# Altium schematic sheet Sheet2.SchDoc
size A4
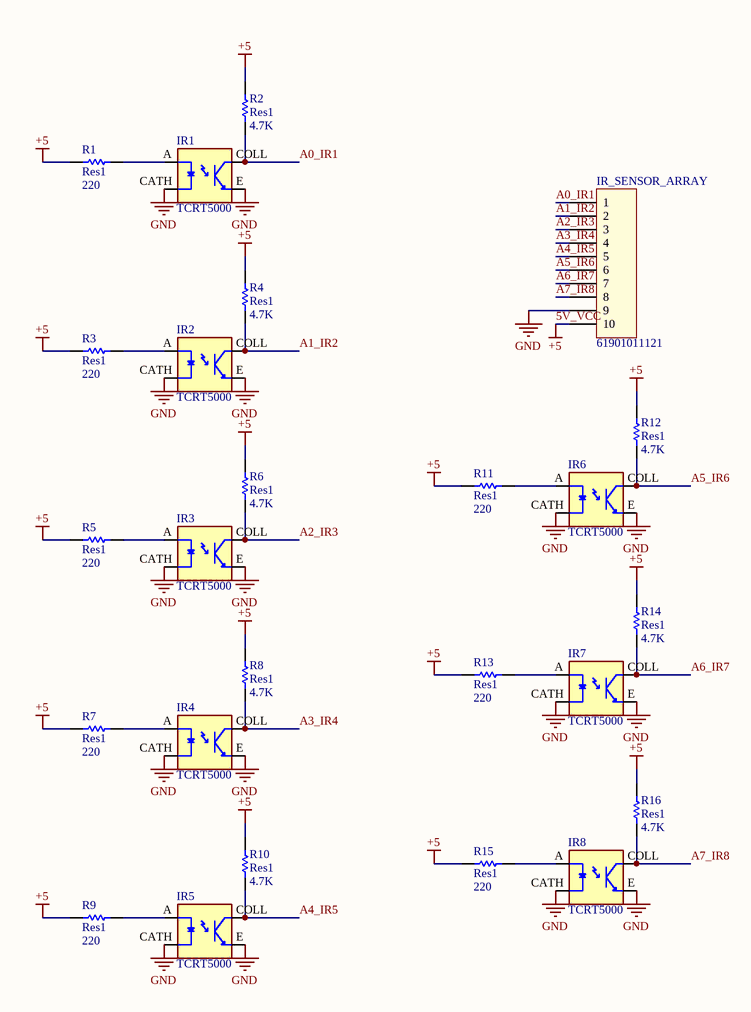
[diagram p0: Sheet2.SchDoc]

## Parts
IR1  TCRT5000  [OPTO_TCRT5000]
IR2  TCRT5000  [OPTO_TCRT5000]
IR3  TCRT5000  [OPTO_TCRT5000]
IR4  TCRT5000  [OPTO_TCRT5000]
IR5  TCRT5000  [OPTO_TCRT5000]
IR6  TCRT5000  [OPTO_TCRT5000]
IR7  TCRT5000  [OPTO_TCRT5000]
IR8  TCRT5000  [OPTO_TCRT5000]
IR_SENSOR_ARRAY  61901011121  [61901011121]
R1  Res1  value 220  [AXIAL-0.3]
R2  Res1  value 4.7K  [AXIAL-0.3]
R3  Res1  value 220  [AXIAL-0.3]
R4  Res1  value 4.7K  [AXIAL-0.3]
R5  Res1  value 220  [AXIAL-0.3]
R6  Res1  value 4.7K  [AXIAL-0.3]
R7  Res1  value 220  [AXIAL-0.3]
R8  Res1  value 4.7K  [AXIAL-0.3]
R9  Res1  value 220  [AXIAL-0.3]
R10  Res1  value 4.7K  [AXIAL-0.3]
R11  Res1  value 220  [AXIAL-0.3]
R12  Res1  value 4.7K  [AXIAL-0.3]
R13  Res1  value 220  [AXIAL-0.3]
R14  Res1  value 4.7K  [AXIAL-0.3]
R15  Res1  value 220  [AXIAL-0.3]
R16  Res1  value 4.7K  [AXIAL-0.3]

## Nets
5V_VCC: IR_SENSOR_ARRAY.10 R1.1 R2.2 R3.1 R4.2 R5.1 R6.2 R7.1 R8.2 R9.1 R10.2 R11.1 R12.2 R13.1 R14.2 R15.1 R16.2  [also labelled +5]
GND: IR1.CATH IR1.E IR2.CATH IR2.E IR3.CATH IR3.E IR4.CATH IR4.E IR5.CATH IR5.E IR6.CATH IR6.E IR7.CATH IR7.E IR8.CATH IR8.E IR_SENSOR_ARRAY.9
A0_IR1: IR1.COLL IR_SENSOR_ARRAY.1 R2.1
A1_IR2: IR2.COLL IR_SENSOR_ARRAY.2 R4.1
A2_IR3: IR3.COLL IR_SENSOR_ARRAY.3 R6.1
A3_IR4: IR4.COLL IR_SENSOR_ARRAY.4 R8.1
A4_IR5: IR5.COLL IR_SENSOR_ARRAY.5 R10.1
A5_IR6: IR6.COLL IR_SENSOR_ARRAY.6 R12.1
A6_IR7: IR7.COLL IR_SENSOR_ARRAY.7 R14.1
A7_IR8: IR8.COLL IR_SENSOR_ARRAY.8 R16.1
NetIR1_A: IR1.A R1.2
NetIR2_A: IR2.A R3.2
NetIR3_A: IR3.A R5.2
NetIR4_A: IR4.A R7.2
NetIR5_A: IR5.A R9.2
NetIR6_A: IR6.A R11.2
NetIR7_A: IR7.A R13.2
NetIR8_A: IR8.A R15.2

## Library data of the parts
IR1-IR8 = TCRT5000: 950 nm 60 mA Through Hole Reflective Optical Sensor with Transistor Output; Availability: Unavailable; MP: TCRT5000; Value: *; Price: None; Package: None
IR_SENSOR_ARRAY = 61901011121: WR-WTB 2.54mm Male Locking Header, 10p; Pin Number: 10; ComponentLink1Description: Manufacturer; ComponentLink1URL: http://www.we-online.de; ComponentLink2Description: Datasheet; ComponentLink2URL: http://katalog.we-online.de/em/datasheet/6190xx11121.pdf; Part Number: 61901011121; Published Date: June 2017; Publisher: Wurth Elektronik; Pitch: 2.54 mm
R1-R16 = Res1: Resistor; Published: 8-Jun-2000; LatestRevisionDate: 17-Jul-2002; LatestRevisionNote: Re-released for DXP Platform.; PackageReference: AXIAL-0.3; Publisher: Altium Limited; PackageDescription: Axial Device, Thru-Hole; 2 Leads; 0.3 in Pin Spacing